# EAGLE schematic owi-slave (EAGLE 6.6.0)
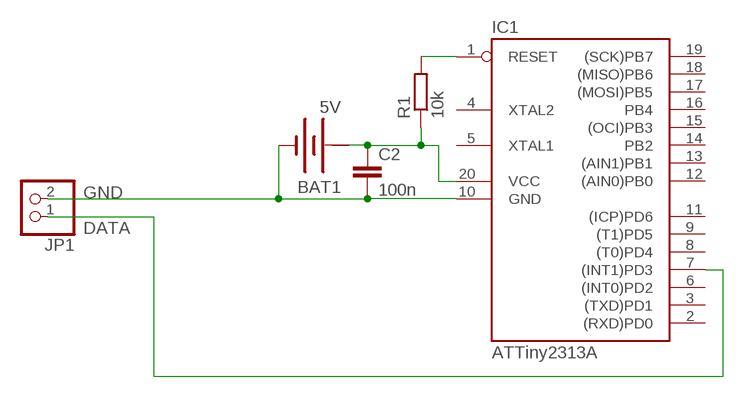
[diagram p0: schematic, sheet 1]

## Parts
BAT1  5V  BATTERY  [BATTERY]
C2  100n  C-EU025-024X044  [C025-024X044]
IC1  ATTiny2313A  AT90S2313P  [DIL20]
JP1  PINHD-1X2  [1X02]
R1  10k  R-EU_0207/10  [0207/10]

## Nets
DATA: IC1.7((INT1)PD3) JP1.1
GND: BAT1.- C2.2 IC1.10(GND) JP1.2
N$1: BAT1.+ C2.1 IC1.20(VCC) R1.1
N$2: IC1.1(RESET) R1.2
Unconnected: IC1.2((RXD)PD0) IC1.3((TXD)PD1) IC1.4(XTAL2) IC1.5(XTAL1) IC1.6((INT0)PD2) IC1.8((T0)PD4) IC1.9((T1)PD5) IC1.11((ICP)PD6) IC1.12((AIN0)PB0) IC1.13((AIN1)PB1) IC1.14(PB2) IC1.15((OCI)PB3) IC1.16(PB4) IC1.17((MOSI)PB5) IC1.18((MISO)PB6) IC1.19((SCK)PB7)

## Power pins joined to a net without a drawn wire
+: BAT1.+@1(+)

## Library data of the parts
BAT1 = special:BATTERY: BATTERY
C2 = resistor:C-EU: CAPACITOR, European symbol
IC1 = atmel:AT90S2313: MICROCONTROLLER 2 Kbytes FLASH 128 bytes SRAM 128 bytes EEPROM UART; OC_FARNELL: unknown; OC_NEWARK: unknown
JP1 = pinhead:PINHD-1X2: PIN HEADER
R1 = resistor:R-EU_: RESISTOR, European symbol